# Altium schematic sheet STM32.SchDoc
size A3
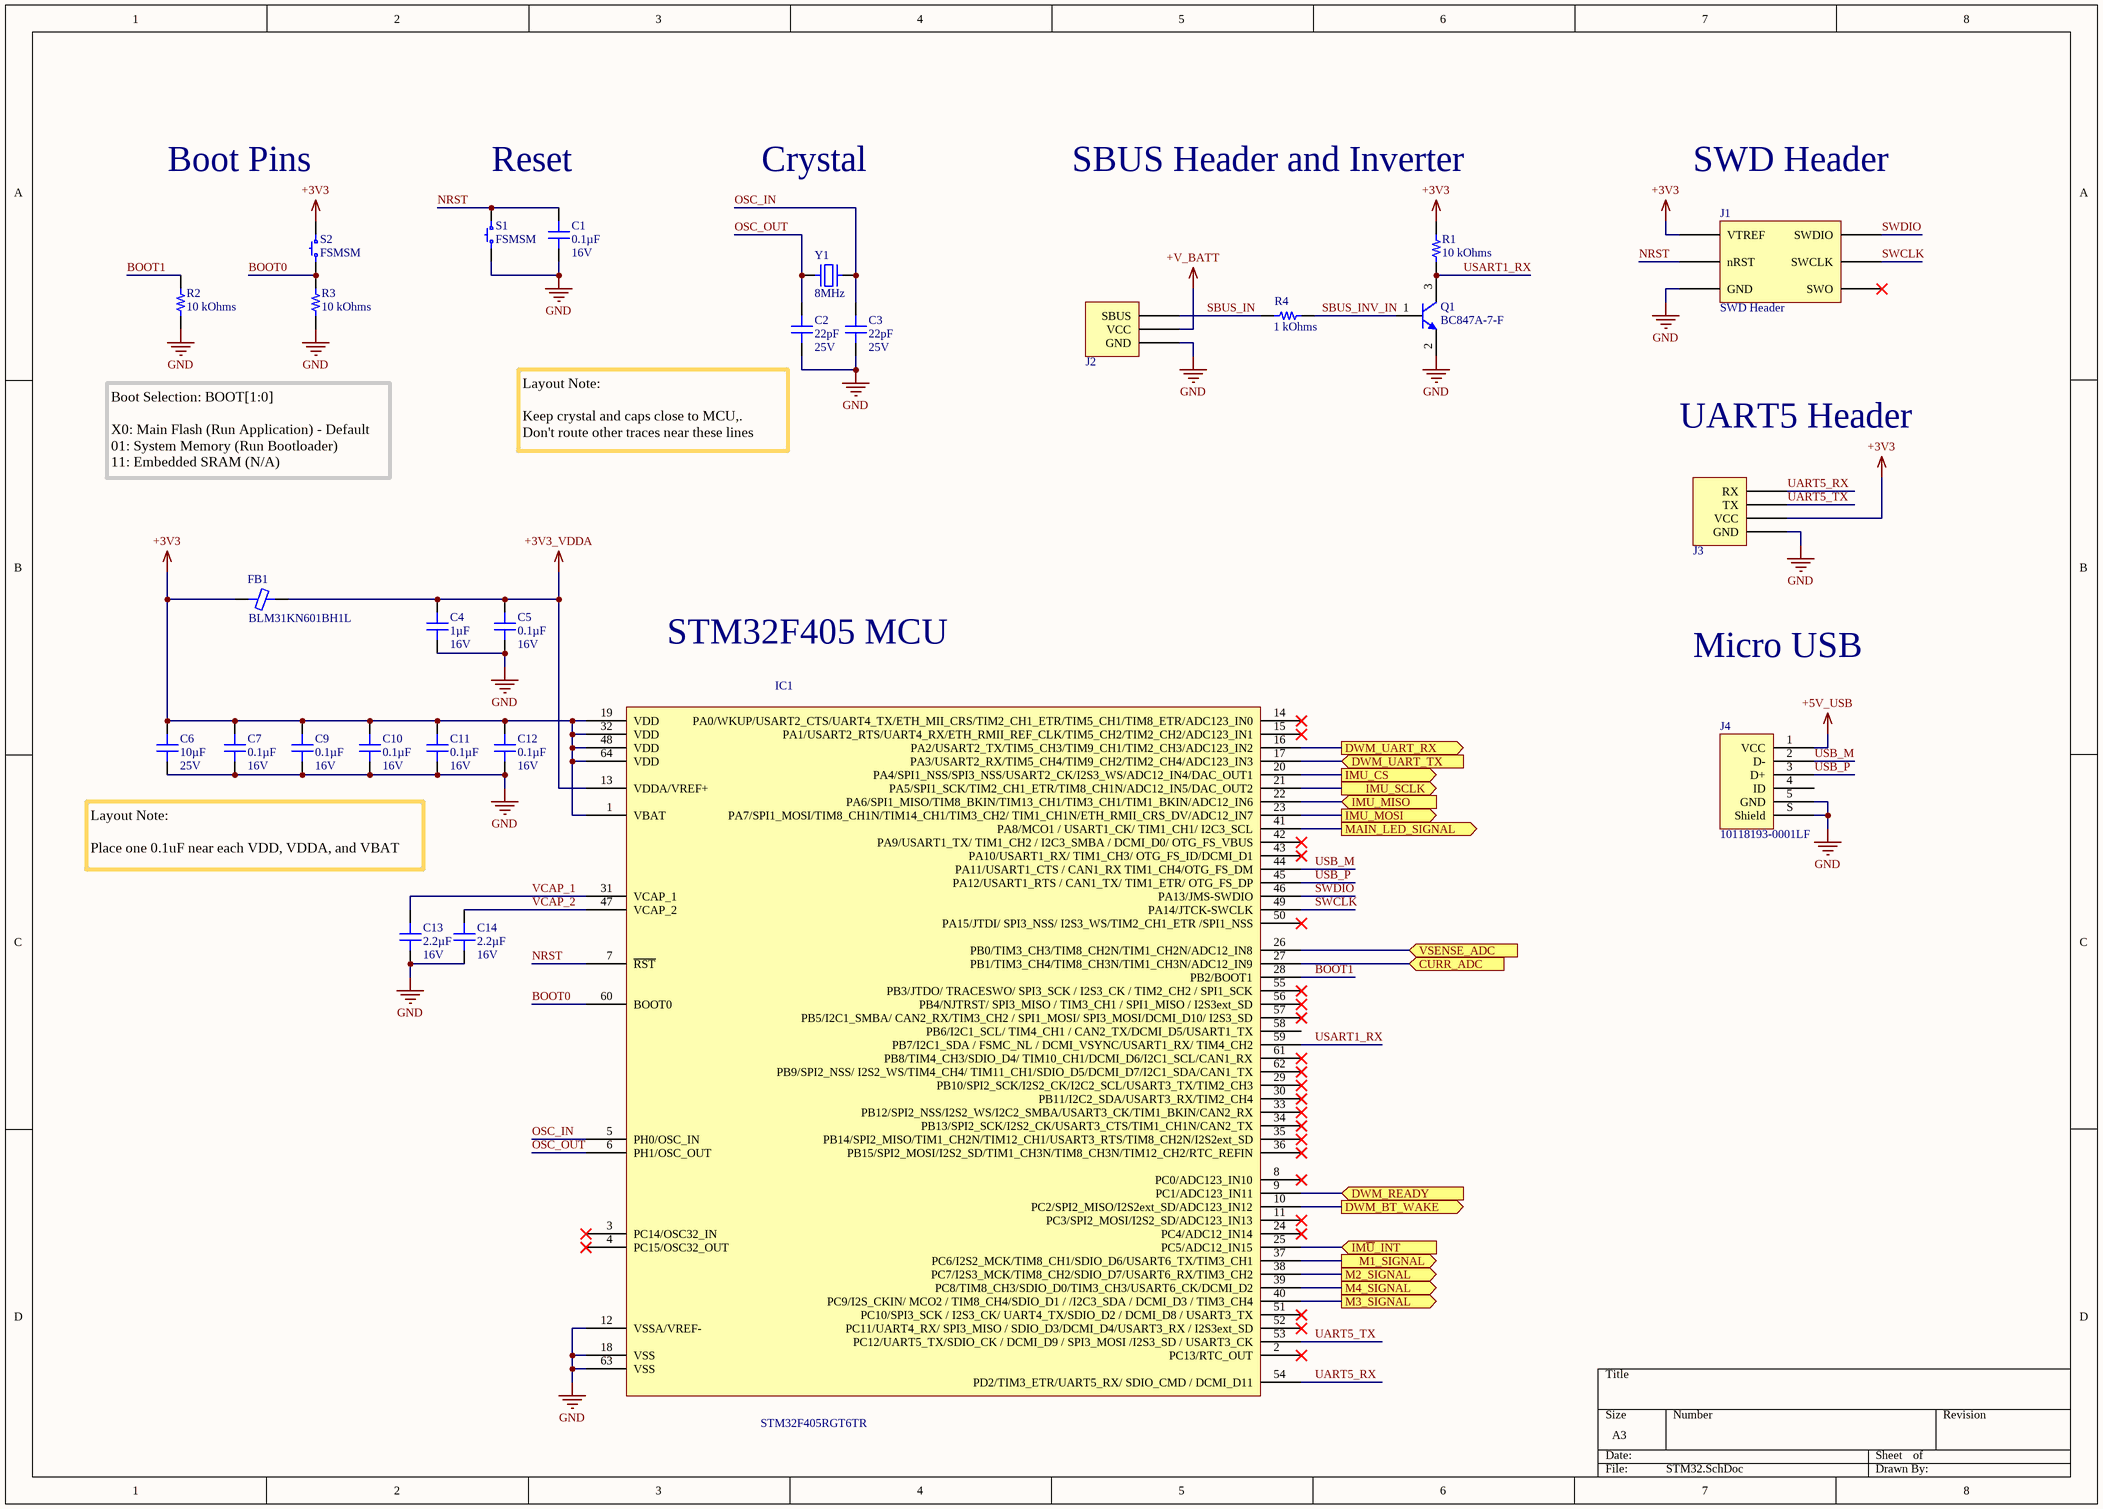
[diagram p0: STM32.SchDoc]

## Parts
C1  Voltage - Rated: 16V  [CAP 0603_1608]  (hidden comment: 0.1µF)
C2  Voltage - Rated: 25V  [CAP 0603_1608]  (hidden comment: 22pF)
C3  Voltage - Rated: 25V  [CAP 0603_1608]  (hidden comment: 22pF)
C4  Voltage - Rated: 16V  [CAP 0603_1608]  (hidden comment: 1µF)
C5  Voltage - Rated: 16V  [CAP 0603_1608]  (hidden comment: 0.1µF)
C6  Voltage - Rated: 25V  [CAP 0603_1608]  (hidden comment: 10µF)
C7  Voltage - Rated: 16V  [CAP 0603_1608]  (hidden comment: 0.1µF)
C9  Voltage - Rated: 16V  [CAP 0603_1608]  (hidden comment: 0.1µF)
C10  Voltage - Rated: 16V  [CAP 0603_1608]  (hidden comment: 0.1µF)
C11  Voltage - Rated: 16V  [CAP 0603_1608]  (hidden comment: 0.1µF)
C12  Voltage - Rated: 16V  [CAP 0603_1608]  (hidden comment: 0.1µF)
C13  Voltage - Rated: 16V  [CAP 0603_1608]  (hidden comment: 2.2µF)
C14  Voltage - Rated: 16V  [CAP 0603_1608]  (hidden comment: 2.2µF)
FB1  BLM31KN601BH1L  [FER 1206_3216]
IC1  STM32F405RGT6TR  [ST LQFP-64 10X10MM]
J1  SWD Header  [SWD Header]  (no BOM)
J2  SBUS Header  [SBUS Header]  (value not drawn)  (no BOM)
J3  UART Header  [UART Header]  (value not drawn)  (no BOM)
J4  10118193-0001LF  [FCI USB 10118193-0001LF]
Q1  BC847A-7-F  [DIODES SOT-23-3]
R1  10 kOhms  [RES 0603_1608]
R2  10 kOhms  [RES 0603_1608]
R3  10 kOhms  [RES 0603_1608]
R4  1 kOhms  [RES 0603_1608]
S1  FSMSM  [TE FSMSMTR]
S2  FSMSM  [TE FSMSMTR]
Y1  8MHz  [ABRACON ABLS]

## Ports
CURR_ADC (in), DWM_BT_WAKE (out), DWM_READY (in), DWM_UART_RX (out), DWM_UART_TX (in), IMU_CS (out), IMU_MISO (in), IMU_MOSI (out), IMU_SCLK (out), IM~{U}_INT (in), M1_SIGNAL (out), M2_SIGNAL (out), M3_SIGNAL (out), M4_SIGNAL (out), MAIN_LED_SIGNAL (out), VSENSE_ADC (in)

## Nets
+3V3: C6.2 C7.2 C9.2 C10.2 C11.2 C12.2 FB1.1 IC1.1(VBAT) IC1.19(VDD) IC1.32(VDD) IC1.48(VDD) IC1.64(VDD) J1.VTREF J3.VCC R1.2 S2.2
+3V3_VDDA: C4.2 C5.2 FB1.2 IC1.13(VDDA/VREF+)
+5V_USB: J4.1(VCC)
+V_BATT: J2.VCC
GND: C1.1 C2.1 C3.1 C4.1 C5.1 C6.1 C7.1 C9.1 C10.1 C11.1 C12.1 C13.1 C14.1 IC1.12(VSSA/VREF-) IC1.18(VSS) IC1.63(VSS) J1.GND J2.GND J3.GND J4.5(GND) J4.S(Shield) Q1.2(E) R2.1 R3.1 S1.1
BOOT0: IC1.60(BOOT0) R3.2 S2.1
BOOT1: IC1.28(PB2/BOOT1) R2.2
CURR_ADC: IC1.27(PB1/TIM3_CH4/TIM8_CH3N/TIM1_CH3N/ADC12_IN9) ; port CURR_ADC
DWM_BT_WAKE: IC1.10(PC2/SPI2_MISO/I2S2ext_SD/ADC123_IN12) ; port DWM_BT_WAKE
DWM_READY: IC1.9(PC1/ADC123_IN11) ; port DWM_READY
DWM_UART_RX: IC1.16(PA2/USART2_TX/TIM5_CH3/TIM9_CH1/TIM2_CH3/ADC123_IN2) ; port DWM_UART_RX
DWM_UART_TX: IC1.17(PA3/USART2_RX/TIM5_CH4/TIM9_CH2/TIM2_CH4/ADC123_IN3) ; port DWM_UART_TX
IM~{U}_INT: IC1.25(PC5/ADC12_IN15) ; port IM~{U}_INT
IMU_CS: IC1.20(PA4/SPI1_NSS/SPI3_NSS/USART2_CK/I2S3_WS/ADC12_IN4/DAC_OUT1) ; port IMU_CS
IMU_MISO: IC1.22(PA6/SPI1_MISO/TIM8_BKIN/TIM13_CH1/TIM3_CH1/TIM1_BKIN/ADC12_IN6) ; port IMU_MISO
IMU_MOSI: IC1.23(PA7/SPI1_MOSI/TIM8_CH1N/TIM14_CH1/TIM3_CH2/_TIM1_CH1N/ETH_RMII_CRS_DV/ADC12_IN7) ; port IMU_MOSI
IMU_SCLK: IC1.21(PA5/SPI1_SCK/TIM2_CH1_ETR/TIM8_CH1N/ADC12_IN5/DAC_OUT2) ; port IMU_SCLK
M1_SIGNAL: IC1.37(PC6/I2S2_MCK/TIM8_CH1/SDIO_D6/USART6_TX/TIM3_CH1) ; port M1_SIGNAL
M2_SIGNAL: IC1.38(PC7/I2S3_MCK/TIM8_CH2/SDIO_D7/USART6_RX/TIM3_CH2) ; port M2_SIGNAL
M3_SIGNAL: IC1.40(PC9/I2S_CKIN/_MCO2_/_TIM8_CH4/SDIO_D1_/_/I2C3_SDA_/_DCMI_D3_/_TIM3_CH4) ; port M3_SIGNAL
M4_SIGNAL: IC1.39(PC8/TIM8_CH3/SDIO_D0/TIM3_CH3/USART6_CK/DCMI_D2) ; port M4_SIGNAL
MAIN_LED_SIGNAL: IC1.41(PA8/MCO1_/_USART1_CK/_TIM1_CH1/_I2C3_SCL) ; port MAIN_LED_SIGNAL
NRST: C1.2 IC1.7(~{RST}) J1.nRST S1.2
OSC_IN: C3.2 IC1.5(PH0/OSC_IN) Y1.1
OSC_OUT: C2.2 IC1.6(PH1/OSC_OUT) Y1.2
SBUS_IN: J2.SBUS R4.1
SBUS_INV_IN: Q1.1(B) R4.2
SWCLK: IC1.49(PA14/JTCK-SWCLK) J1.SWCLK
SWDIO: IC1.46(PA13/JMS-SWDIO) J1.SWDIO
UART5_RX: IC1.54(PD2/TIM3_ETR/UART5_RX/_SDIO_CMD_/_DCMI_D11) J3.RX
UART5_TX: IC1.53(PC12/UART5_TX/SDIO_CK_/_DCMI_D9_/_SPI3_MOSI_/I2S3_SD_/_USART3_CK) J3.TX
USART1_RX: IC1.59(PB7/I2C1_SDA_/_FSMC_NL_/_DCMI_VSYNC/USART1_RX/_TIM4_CH2) Q1.3(C) R1.1
USB_M: IC1.44(PA11/USART1_CTS_/_CAN1_RX_TIM1_CH4/OTG_FS_DM) J4.2(D-)
USB_P: IC1.45(PA12/USART1_RTS_/_CAN1_TX/_TIM1_ETR/_OTG_FS_DP) J4.3(D+)
VCAP_1: C13.2 IC1.31(VCAP_1)
VCAP_2: C14.2 IC1.47(VCAP_2)
VSENSE_ADC: IC1.26(PB0/TIM3_CH3/TIM8_CH2N/TIM1_CH2N/ADC12_IN8) ; port VSENSE_ADC

Not connected (* = marked no-connect by the designer): IC1 2(PC13/RTC_OUT)* 3(PC14/OSC32_IN)* 4(PC15/OSC32_OUT)* 8(PC0/ADC123_IN10)* 11(PC3/SPI2_MOSI/I2S2_SD/ADC123_IN13)* 14(PA0/WKUP/USART2_CTS/UART4_TX/ETH_MII_CRS/TIM2_CH1_ETR/TIM5_CH1/TIM8_ETR/ADC123_IN0)* 15(PA1/USART2_RTS/UART4_RX/ETH_RMII_REF_CLK/TIM5_CH2/TIM2_CH2/ADC123_IN1)* 24(PC4/ADC12_IN14)* 29(PB10/SPI2_SCK/I2S2_CK/I2C2_SCL/USART3_TX/TIM2_CH3)* 30(PB11/I2C2_SDA/USART3_RX/TIM2_CH4)* 33(PB12/SPI2_NSS/I2S2_WS/I2C2_SMBA/USART3_CK/TIM1_BKIN/CAN2_RX)* 34(PB13/SPI2_SCK/I2S2_CK/USART3_CTS/TIM1_CH1N/CAN2_TX)* 35(PB14/SPI2_MISO/TIM1_CH2N/TIM12_CH1/USART3_RTS/TIM8_CH2N/I2S2ext_SD)* 36(PB15/SPI2_MOSI/I2S2_SD/TIM1_CH3N/TIM8_CH3N/TIM12_CH2/RTC_REFIN)* 42(PA9/USART1_TX/_TIM1_CH2_/_I2C3_SMBA_/_DCMI_D0/_OTG_FS_VBUS)* 43(PA10/USART1_RX/_TIM1_CH3/_OTG_FS_ID/DCMI_D1)* 50(PA15/JTDI/_SPI3_NSS/_I2S3_WS/TIM2_CH1_ETR_/SPI1_NSS)* 51(PC10/SPI3_SCK_/_I2S3_CK/_UART4_TX/SDIO_D2_/_DCMI_D8_/_USART3_TX)* 52(PC11/UART4_RX/_SPI3_MISO_/_SDIO_D3/DCMI_D4/USART3_RX_/_I2S3ext_SD)* 55(PB3/JTDO/_TRACESWO/_SPI3_SCK_/_I2S3_CK_/_TIM2_CH2_/_SPI1_SCK)* 56(PB4/NJTRST/_SPI3_MISO_/_TIM3_CH1_/_SPI1_MISO_/_I2S3ext_SD)* 57(PB5/I2C1_SMBA/_CAN2_RX/TIM3_CH2_/_SPI1_MOSI/_SPI3_MOSI/DCMI_D10/_I2S3_SD)* 58(PB6/I2C1_SCL/_TIM4_CH1_/_CAN2_TX/DCMI_D5/USART1_TX) 61(PB8/TIM4_CH3/SDIO_D4/_TIM10_CH1/DCMI_D6/I2C1_SCL/CAN1_RX)* 62(PB9/SPI2_NSS/_I2S2_WS/TIM4_CH4/_TIM11_CH1/SDIO_D5/DCMI_D7/I2C1_SDA/CAN1_TX)*; J1 SWO*; J4 4(ID)

## Notes on the sheet
- Boot Pins
- Reset
- Crystal
- SBUS Header and Inverter
- SWD Header
- (near C2) Layout Note:
  Keep crystal and caps close to MCU,.
  Don't route other traces near these lines
- UART5 Header
- Boot Selection: BOOT[1:0]
  X0: Main Flash (Run Application) - Default
  01: System Memory (Run Bootloader)
  11: Embedded SRAM (N/A)
- STM32F405 MCU
- Micro USB
- Layout Note:
  Place one 0.1uF near each VDD, VDDA, and VBAT

## Library data of the parts
C1 C5 C7 C9-C12 = CC0603KRX7R7BB104: CAP CER 0.1UF 16V X7R 0603; Manufacturer: Yageo; Tolerance: ±10%; Part Number: CC0603KRX7R7BB104; Value: 0.1µF; Applications: General Purpose; Capacitance: 0.1µF; ComponentLink1Description: Datasheet; ComponentLink1URL: https://www.yageo.com/upload/media/product/productsearch/datasheet/mlcc/UPY-GPHC_X7R_6.3V-to-50V_18.pdf; ComponentLink2Description: DigiKey Link; ComponentLink2URL: http://digikey.com/product-detail/en/yageo/CC0603KRX7R7BB104/311-1088-1-ND/302998; Device Package: 0603 (1608 Metric); LastUpdated: 9/2/2020 1:03:05 AM; Lifecycle Status: Active; Minimum Order: 1; Mounting Type: Surface Mount, MLCC; Operating Temperature: -55°C ~ 125°C; Package / Case: 0603 (1608 Metric); Packaging: TapeAndReel; PartId: 16746; Part Status: Active; Price: 0.01; Series: CC; Size / Dimension: 0.063" L x 0.031" W (1.60mm x 0.80mm); Supplier 1: DigiKey; Supplier Part Number 1: 311-1088-1-ND; Temperature Coefficient: X7R; Thickness (Max): 0.035" (0.90mm)
C2 C3 = CC0603JRNPO8BN220: CAP CER 22PF 25V NPO 0603; Manufacturer: Yageo; Temperature Coefficient: C0G, NP0; Tolerance: ±5%; Part Number: CC0603JRNPO8BN220; Value: 22pF; Applications: General Purpose; Capacitance: 22pF; ComponentLink1Description: Datasheet; ComponentLink1URL: https://www.yageo.com/upload/media/product/productsearch/datasheet/mlcc/UPY-GP_NP0_16V-to-50V_17.pdf; ComponentLink2Description: DigiKey Link; ComponentLink2URL: http://digikey.com/product-detail/en/yageo/CC0603JRNPO8BN220/311-3952-1-ND/8025041; Device Package: 0603 (1608 Metric); LastUpdated: 9/2/2020 1:03:33 AM; Lifecycle Status: Active; Minimum Order: 1; Mounting Type: Surface Mount, MLCC; Operating Temperature: -55°C ~ 125°C; Package / Case: 0603 (1608 Metric); Packaging: TapeAndReel; PartId: 3642; Part Status: Active; Price: 0.01; Series: CC; Size / Dimension: 0.063" L x 0.031" W (1.60mm x 0.80mm); Supplier 1: DigiKey; Supplier Part Number 1: 311-3952-1-ND; Thickness (Max): 0.035" (0.90mm)
C4 = CC0603MRX5R7BB105: CAP CER 1UF 16V X5R 0603; Manufacturer: Yageo; Tolerance: ±20%; Part Number: CC0603MRX5R7BB105; Value: 1µF; Applications: General Purpose; Capacitance: 1µF; ComponentLink1Description: Datasheet; ComponentLink1URL: https://www.yageo.com/upload/media/product/productsearch/datasheet/mlcc/UPY-GPHC_X5R_4V-to-50V_25.pdf; ComponentLink2Description: DigiKey Link; ComponentLink2URL: http://digikey.com/product-detail/en/yageo/CC0603MRX5R7BB105/311-1821-1-ND/5195723; Device Package: 0603 (1608 Metric); LastUpdated: 9/2/2020 1:03:23 AM; Lifecycle Status: Active; Minimum Order: 1; Mounting Type: Surface Mount, MLCC; Operating Temperature: -55°C ~ 85°C; Package / Case: 0603 (1608 Metric); Packaging: TapeAndReel; PartId: 9229; Part Status: Active; Price: 0.02; Series: CC; Size / Dimension: 0.063" L x 0.031" W (1.60mm x 0.80mm); Supplier 1: DigiKey; Supplier Part Number 1: 311-1821-1-ND; Temperature Coefficient: X5R; Thickness (Max): 0.035" (0.90mm)
C6 = CC0603MRX5R8BB106: CAP CER 10UF 25V X5R 0603; Manufacturer: Yageo; Tolerance: ±20%; Part Number: CC0603MRX5R8BB106; Value: 10µF; Applications: General Purpose; Capacitance: 10µF; ComponentLink1Description: Datasheet; ComponentLink1URL: https://www.yageo.com/upload/media/product/productsearch/datasheet/mlcc/UPY-GPHC_X5R_4V-to-50V_25.pdf; ComponentLink2Description: DigiKey Link; ComponentLink2URL: http://digikey.com/product-detail/en/yageo/CC0603MRX5R8BB106/311-3494-1-ND/7164515; Device Package: 0603 (1608 Metric); LastUpdated: 9/2/2020 1:02:55 AM; Lifecycle Status: Active; Minimum Order: 1; Mounting Type: Surface Mount, MLCC; Operating Temperature: -55°C ~ 85°C; Package / Case: 0603 (1608 Metric); Packaging: TapeAndReel; PartId: 27362; Part Status: Active; Price: 0.20; Series: CC; Supplier 1: DigiKey; Supplier Part Number 1: 311-3494-1-ND; Temperature Coefficient: X5R
C13 C14 = CC0603KRX5R7BB225: CAP CER 2.2UF 16V X5R 0603; Manufacturer: Yageo; Tolerance: ±10%; Part Number: CC0603KRX5R7BB225; Value: 2.2µF; Applications: General Purpose; Capacitance: 2.2µF; ComponentLink1Description: Datasheet; ComponentLink1URL: https://www.yageo.com/upload/media/product/productsearch/datasheet/mlcc/UPY-GPHC_X5R_4V-to-50V_25.pdf; ComponentLink2Description: DigiKey Link; ComponentLink2URL: http://digikey.com/product-detail/en/yageo/CC0603KRX5R7BB225/311-1784-1-ND/5195686; Device Package: 0603 (1608 Metric); LastUpdated: 9/2/2020 1:03:11 AM; Lifecycle Status: Active; Minimum Order: 1; Mounting Type: Surface Mount, MLCC; Operating Temperature: -55°C ~ 85°C; Package / Case: 0603 (1608 Metric); Packaging: TapeAndReel; PartId: 15051; Part Status: Active; Price: 0.03; Series: CC; Size / Dimension: 0.063" L x 0.031" W (1.60mm x 0.80mm); Supplier 1: DigiKey; Supplier Part Number 1: 311-1784-1-ND; Temperature Coefficient: X5R; Thickness (Max): 0.035" (0.90mm)
FB1 = BLM31KN601BH1L: 600OHM DCR MAX 2) A RATED CURREN; Manufacturer: Murata Electronics; Current Rating (Max): 2A; DC Resistance (DCR) (Max): 38mOhm; Filter Type: Power Line; Number of Lines: 1; Part Number: BLM31KN601BH1L; ComponentLink1Description: Datasheet; ComponentLink1URL: https://www.murata.com/en-global/products/productdata/8800169623582/QNFA9138.pdf; ComponentLink2Description: DigiKey Link; ComponentLink2URL: http://digikey.com/product-detail/en/murata-electronics/BLM31KN601BH1L/490-18087-1-ND/9559599; Device Package: 1206 (3216 Metric); Height (Max): 0.071" (1.80mm); LastUpdated: 9/2/2020 1:18:24 AM; Lifecycle Status: Active; Minimum Order: 1; Mounting Type: Surface Mount; Operating Temperature: -55°C ~ 150°C; Package / Case: 1206 (3216 Metric); Packaging: TapeAndReel; PartId: 1583; Part Status: Active; Price: 0.10; Ratings: AEC-Q200; Series: EMIFIL®, BLM31; Size / Dimension: 0.126" L x 0.063" W (3.20mm x 1.60mm); Supplier 1: DigiKey; Supplier Part Number 1: 490-18087-1-ND
IC1 = STM32F405RGT6TR: IC MCU 32BIT 1MB FLASH 64LQFP; Manufacturer: STMicroelectronics; Connectivity: CANbus, I²C, IrDA, LINbus, SPI, UART/USART, USB OTG; Core Processor: ARM® Cortex®-M4; Core Size: 32-Bit; Data Converters: A/D 16x12b; D/A 2x12b; Number of I/O: 51; Oscillator Type: Internal; Peripherals: Brown-out Detect/Reset, DMA, I²S, LCD, POR, PWM, WDT; Program Memory Size: 1MB (1M x 8); RAM Size: 192K x 8; Speed: 168MHz; Voltage - Supply (Vcc/Vdd): 1.8V ~ 3.6V; Part Number: STM32F405RGT6TR; ComponentLink1Description: Datasheet; ComponentLink1URL: http://www.st.com/content/ccc/resource/technical/document/datasheet/ef/92/76/6d/bb/c2/4f/f7/DM00037051.pdf/files/DM00037051.pdf/jcr:content/translations/en.DM00037051.pdf; ComponentLink2Description: DigiKey Link; ComponentLink2URL: //digikey.com/product-detail/en/stmicroelectronics/STM32F405RGT6TR/497-17432-2-ND/4755958; Device Package: 64-LQFP; LastUpdated: 12/5/2019 11:45:59 PM; Lifecycle Status: 0; Minimum Order: 1; Mounting Type: Surface Mount; Operating Temperature: -40°C ~ 85°C (TA); Package / Case: 64-LQFP; Packaging: TapeAndReel; PartId: 118; Part Status: Active; Price: 6.14; Program Memory Type: FLASH; Series: STM32F4; Supplier 1: DigiKey; Supplier Part Number 1: 497-17432-2-ND; Supplier Device Package: 64-LQFP (10x10)
J4 = 10118193-0001LF: CONN RCPT USB2.0 MICRO B SMD R/A; Manufacturer: Amphenol ICC (FCI); Connector Type: USB - micro B; Current Rating (Amps): 1.8A per Contact; Gender: Receptacle; Mating Cycles: 10000; Number of Contacts: 5; Number of Ports: 1; Shielding: Shielded; Voltage - Rated: 100VAC; Part Number: 10118193-0001LF; ComponentLink1Description: Datasheet; ComponentLink1URL: https://cdn.amphenol-icc.com/media/wysiwyg/files/documentation/datasheet/inputoutput/io_usb_micro.pdf; ComponentLink2Description: DigiKey Link; ComponentLink2URL: //digikey.com/product-detail/en/amphenol-icc-fci/10118193-0001LF/609-4616-2-ND/2785388; Features: Solder Retention; LastUpdated: 12/9/2019 8:51:28 PM; Lifecycle Status: 0; Minimum Order: 1; Mounting Feature: Horizontal; Mounting Type: Surface Mount, Right Angle; Through Hole; Operating Temperature: -30°C ~ 80°C; Packaging: TapeAndReel; Part Status: Active; Price: 0.21; Series: -; Specifications: USB 2.0; Supplier 1: DigiKey; Supplier Part Number 1: 609-4616-2-ND; Termination: Solder
Q1 = BC847A-7-F: TRANS NPN 45V 0.1A SOT23-3; Manufacturer: Diodes Incorporated; Current - Collector Cutoff (Max): 15nA; Current - Collector (Ic) (Max): 100mA; DC Current Gain (hFE) (Min) @ Ic, Vce: 110 @ 2mA, 5V; Frequency - Transition: 300MHz; Power - Max: 300mW; Vce Saturation (Max) @ Ib, Ic: 600mV @ 5mA, 100mA; Part Number: BC847A-7-F; ComponentLink1Description: Datasheet; ComponentLink1URL: https://www.diodes.com/assets/Datasheets/ds11108.pdf; ComponentLink2Description: DigiKey Link; ComponentLink2URL: http://digikey.com/product-detail/en/diodes-incorporated/BC847A-7-F/BC847A-7FDICT-ND/2181058; LastUpdated: 9/2/2020 1:30:07 AM; Lifecycle Status: Active; Minimum Order: 1; Mounting Type: Surface Mount; Operating Temperature: -65°C ~ 150°C (TJ); Package / Case: TO-236-3, SC-59, SOT-23-3; Packaging: TapeAndReel; PartId: 122; Part Status: Active; Price: 0.03; Series: -; Supplier 1: DigiKey; Supplier Part Number 1: BC847A-7FDICT-ND; Supplier Device Package: SOT-23-3; Transistor Type: NPN; Voltage - Collector Emitter Breakdown (Max): 45V
R1-R3 = AC0603FR-0710KL: RES SMD 10K OHM 1% 1/10W 0603; Manufacturer: Yageo; Power (Watts): 0.1W, 1/10W; Temperature Coefficient: ±100ppm/°C; Part Number: AC0603FR-0710KL; Value: 10 kOhms; ComponentLink1Description: Datasheet; ComponentLink1URL: https://www.yageo.com/upload/media/product/productsearch/datasheet/rchip/PYu-AC_51_RoHS_L_7.pdf; ComponentLink2Description: DigiKey Link; ComponentLink2URL: http://digikey.com/product-detail/en/yageo/AC0603FR-0710KL/311-10KLDCT-ND/2828135; Composition: Thick Film; Device Package: 0603 (1608 Metric); Features: Automotive AEC-Q200, Moisture Resistant; Height - Seated (Max): 0.022" (0.55mm); LastUpdated: 9/2/2020 1:09:58 AM; Lifecycle Status: Active; Minimum Order: 1; Number of Terminations: 2; Operating Temperature: -55°C ~ 155°C; Package / Case: 0603 (1608 Metric); Packaging: CutTape; PartId: 17347; Part Status: Active; Price: 0.10; Ratings: AEC-Q200; Resistance: 10 kOhms; Series: AC; Size / Dimension: 0.063" L x 0.031" W (1.60mm x 0.80mm); Supplier 1: DigiKey; Supplier Part Number 1: 311-10KLDCT-ND; Supplier Device Package: 0603; Tolerance: ±1%
R4 = AC0603FR-071KL: RES SMD 1K OHM 1% 1/10W 0603; Manufacturer: Yageo; Power (Watts): 0.1W, 1/10W; Temperature Coefficient: ±100ppm/°C; Part Number: AC0603FR-071KL; Value: 1 kOhms; ComponentLink1Description: Datasheet; ComponentLink1URL: https://www.yageo.com/upload/media/product/productsearch/datasheet/rchip/PYu-AC_51_RoHS_L_7.pdf; ComponentLink2Description: DigiKey Link; ComponentLink2URL: http://digikey.com/product-detail/en/yageo/AC0603FR-071KL/311-1KLDCT-ND/2828140; Composition: Thick Film; Device Package: 0603 (1608 Metric); Features: Automotive AEC-Q200, Moisture Resistant; Height - Seated (Max): 0.022" (0.55mm); LastUpdated: 9/2/2020 1:09:58 AM; Lifecycle Status: Active; Minimum Order: 1; Number of Terminations: 2; Operating Temperature: -55°C ~ 155°C; Package / Case: 0603 (1608 Metric); Packaging: CutTape; PartId: 17353; Part Status: Active; Price: 0.10; Ratings: AEC-Q200; Resistance: 1 kOhms; Series: AC; Size / Dimension: 0.063" L x 0.031" W (1.60mm x 0.80mm); Supplier 1: DigiKey; Supplier Part Number 1: 311-1KLDCT-ND; Supplier Device Package: 0603; Tolerance: ±1%
S1 S2 = FSMSM: SWITCH TACTILE SPST-NO 0.05A 24V; Manufacturer: TE Connectivity ALCOSWITCH Switches; Actuator Height off PCB, Vertical: 4.57mm; Actuator Orientation: Top Actuated; Actuator Type: Standard; Contact Rating @ Voltage: 0.05A @ 24VDC; Illumination: Non-Illuminated; Operating Force: 180gf; Outline: 6.00mm x 3.50mm; Switch Function: Off-Mom; Part Number: FSMSM; Circuit: SPST-NO; ComponentLink1Description: Datasheet; ComponentLink1URL: https://www.te.com/commerce/DocumentDelivery/DDEController?Action=srchrtrv&DocNm=1437566-3&DocType=Customer+Drawing&DocLang=English; ComponentLink2Description: DigiKey Link; ComponentLink2URL: http://digikey.com/product-detail/en/te-connectivity-alcoswitch-switches/FSMSM/450-1140-ND/525812; LastUpdated: 9/2/2020 1:27:08 AM; Lifecycle Status: Active; Minimum Order: 1; Mounting Type: Surface Mount; Operating Temperature: -35°C ~ 85°C; Packaging: Bulk; Part Status: Active; Price: 0.27; Series: FSMSM; Supplier 1: DigiKey; Supplier Part Number 1: 450-1140-ND; Termination Style: Gull Wing
Y1 = ABLS-8.000MHZ-16-A-4-H-T: CRYSTAL 8.0000MHZ 16PF SMD; Manufacturer: Abracon LLC; ESR (Equivalent Series Resistance): 80 Ohms; Frequency Stability: ±35ppm; Frequency Tolerance: ±30ppm; Operating Mode: Fundamental; Part Number: ABLS-8.000MHZ-16-A-4-H-T; ComponentLink1Description: Datasheet; ComponentLink1URL: https://abracon.com/Resonators/abls.pdf; ComponentLink2Description: DigiKey Link; ComponentLink2URL: http://digikey.com/product-detail/en/abracon-llc/ABLS-8.000MHZ-16-A-4-H-T/535-14942-1-ND/9998019; Frequency: 8MHz; Height - Seated (Max): 0.165" (4.20mm); LastUpdated: 9/2/2020 1:21:46 AM; Lifecycle Status: Active; Load Capacitance: 16pF; Minimum Order: 1; Mounting Type: Surface Mount; Operating Temperature: -10°C ~ 60°C; Package / Case: HC-49/US; Packaging: TapeAndReel; PartId: 58; Part Status: Active; Price: 0.11; Series: ABLS; Size / Dimension: 0.449" L x 0.185" W (11.40mm x 4.70mm); Supplier 1: DigiKey; Supplier Part Number 1: 535-14942-1-ND; Type: MHz Crystal; Value: 8MHz